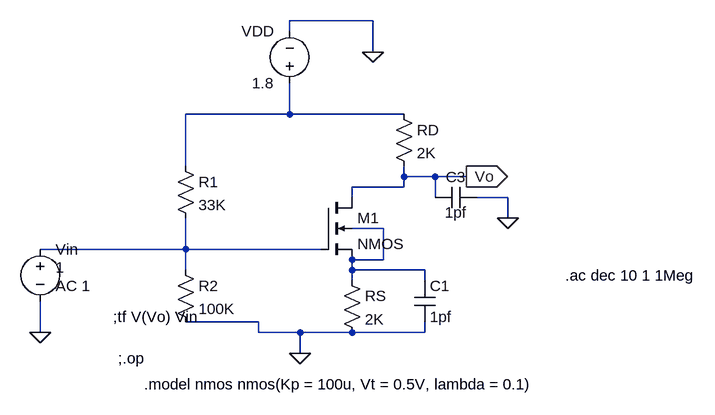
[diagram p0: schematic Exp 2 CS amplifier.asc]
Exp 2 CS amplifier.asc, the LTspice schematic file:
Version 4
SHEET 1 880 680
WIRE 240 -128 112 -128
WIRE 112 -112 112 -128
WIRE 240 -80 240 -128
WIRE 112 16 112 -32
WIRE 112 16 -48 16
WIRE 288 16 112 16
WIRE -48 96 -48 16
WIRE 288 112 288 96
WIRE 336 112 288 112
WIRE 384 112 336 112
WIRE 288 128 288 112
WIRE 288 128 208 128
WIRE 208 144 208 128
WIRE 336 144 336 112
WIRE 448 144 400 144
WIRE 448 176 448 144
WIRE 256 192 208 192
WIRE -48 224 -48 176
WIRE -48 224 -272 224
WIRE 160 224 -48 224
WIRE 256 240 256 192
WIRE 256 240 208 240
WIRE -48 256 -48 224
WIRE 208 256 208 240
WIRE 320 256 208 256
WIRE 208 272 208 256
WIRE 320 272 320 256
WIRE 64 336 -48 336
WIRE -272 352 -272 304
WIRE 64 352 64 336
WIRE 128 352 64 352
WIRE 208 352 128 352
WIRE 320 352 320 336
WIRE 320 352 208 352
WIRE 128 384 128 352
FLAG 240 -80 0
FLAG 128 384 0
FLAG 448 176 0
FLAG -272 352 0
FLAG 384 112 Vo
IOPIN 384 112 Out
SYMBOL res 192 256 R0
SYMATTR InstName RS
SYMATTR Value 2K
SYMBOL res -64 240 R0
SYMATTR InstName R2
SYMATTR Value 100K
SYMBOL res -64 80 R0
SYMATTR InstName R1
SYMATTR Value 33K
SYMBOL res 272 0 R0
SYMATTR InstName RD
SYMATTR Value 2K
SYMBOL cap 304 272 R0
SYMATTR InstName C1
SYMATTR Value 1pf
SYMBOL cap 400 128 R90
WINDOW 0 0 32 VBottom 2
WINDOW 3 55 32 VBottom 2
SYMATTR InstName C3
SYMATTR Value 1pf
SYMBOL voltage 112 -16 R180
WINDOW 0 24 96 Left 2
WINDOW 3 24 16 Left 2
WINDOW 123 0 0 Left 0
WINDOW 39 0 0 Left 0
SYMATTR InstName VDD
SYMATTR Value 1.8
SYMBOL nmos4 160 144 R0
SYMATTR InstName M1
SYMATTR Value2 l=1 w=6
SYMBOL voltage -272 208 R0
WINDOW 3 24 44 Left 2
WINDOW 123 24 72 Left 2
WINDOW 39 0 0 Left 0
SYMATTR InstName Vin
SYMATTR Value 1
SYMATTR Value2 AC 1
TEXT -112 432 Left 2 !.model nmos nmos(Kp = 100u, Vt = 0.5V, lambda = 0.1)
TEXT -152 392 Left 2 !;.op
TEXT 536 264 Left 2 !.ac dec 10 1 1Meg
TEXT -160 328 Left 2 !;tf V(Vo) Vin

The netlist it stands for:
* Exp 2 CS amplifier.asc
RS N002 0 2K
R2 N003 0 100K
R1 N001 N003 33K
RD N001 Vo 2K
C1 N002 0 1pf
C3 0 Vo 1pf
VDD N001 0 1.8
M1 Vo N003 N002 N002 NMOS l=1 w=6
Vin N003 0 1 AC 1
.model NMOS NMOS
.model PMOS PMOS
.lib standard.mos
.model nmos nmos(Kp = 100u, Vt = 0.5V, lambda = 0.1)
;.op
.ac dec 10 1 1Meg
;tf V(Vo) Vin
.backanno
.end